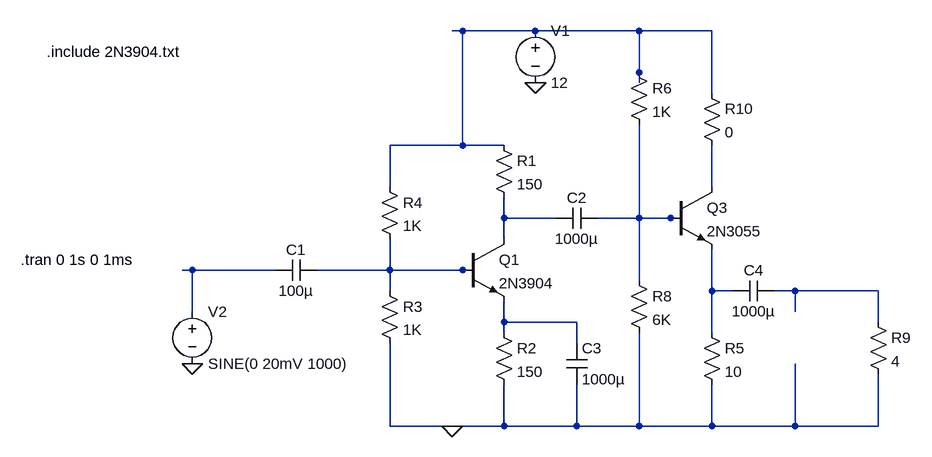
[diagram p0: schematic Common Emitter with 2N3904.asc]
Common Emitter with 2N3904.asc, the LTspice schematic file:
Version 4
SHEET 1 1032 680
WIRE 160 -256 144 -256
WIRE 272 -256 160 -256
WIRE 432 -256 272 -256
WIRE 544 -256 432 -256
WIRE 432 -192 432 -256
WIRE 432 -176 432 -192
WIRE 544 -160 544 -256
WIRE 160 -80 160 -256
WIRE 160 -80 48 -80
WIRE 224 -80 160 -80
WIRE 48 -16 48 -80
WIRE 544 -16 544 -80
WIRE 224 32 224 0
WIRE 304 32 224 32
WIRE 432 32 432 -112
WIRE 432 32 368 32
WIRE 480 32 432 32
WIRE 496 32 480 32
WIRE 224 64 224 32
WIRE -256 112 -272 112
WIRE -128 112 -256 112
WIRE 48 112 48 64
WIRE 48 112 -64 112
WIRE 160 112 48 112
WIRE 176 112 160 112
WIRE 432 128 432 32
WIRE 48 144 48 112
WIRE 544 144 544 80
WIRE 576 144 544 144
WIRE 672 144 640 144
WIRE 800 144 672 144
WIRE -256 176 -256 112
WIRE 672 176 672 144
WIRE 224 192 224 160
WIRE 336 192 224 192
WIRE 800 192 800 144
WIRE 224 208 224 192
WIRE 544 208 544 144
WIRE 336 224 336 192
WIRE 48 352 48 224
WIRE 144 352 48 352
WIRE 224 352 224 288
WIRE 224 352 144 352
WIRE 336 352 336 288
WIRE 336 352 224 352
WIRE 432 352 432 208
WIRE 432 352 336 352
WIRE 544 352 544 288
WIRE 544 352 432 352
WIRE 672 352 672 256
WIRE 672 352 544 352
WIRE 800 352 800 272
WIRE 800 352 672 352
FLAG 272 -176 0
FLAG 144 352 0
FLAG -256 256 0
SYMBOL npn 160 64 R0
SYMATTR InstName Q1
SYMATTR Value 2N3904
SYMBOL res 208 -96 R0
SYMATTR InstName R1
SYMATTR Value 150
SYMBOL voltage 272 -272 R0
WINDOW 123 0 0 Left 2
WINDOW 39 0 0 Left 2
SYMATTR InstName V1
SYMATTR Value 12
SYMBOL res 32 -32 R0
SYMATTR InstName R4
SYMATTR Value 1K
SYMBOL res 32 128 R0
SYMATTR InstName R3
SYMATTR Value 1K
SYMBOL res 208 192 R0
SYMATTR InstName R2
SYMATTR Value 150
SYMBOL cap 320 224 R0
SYMATTR InstName C3
SYMATTR Value 1000µ
SYMBOL voltage -256 160 R0
WINDOW 123 0 0 Left 2
WINDOW 39 0 0 Left 2
SYMATTR InstName V2
SYMATTR Value SINE(0 20mV 1000)
SYMBOL npn2 480 -16 R0
SYMATTR InstName Q3
SYMATTR Value 2N3055
SYMBOL res 528 192 R0
SYMATTR InstName R5
SYMATTR Value 10
SYMBOL cap -64 96 R90
WINDOW 0 0 32 VBottom 2
WINDOW 3 32 32 VTop 2
SYMATTR InstName C1
SYMATTR Value 100µ
SYMBOL res 416 -208 R0
SYMATTR InstName R6
SYMATTR Value 1K
SYMBOL cap 368 16 R90
WINDOW 0 0 32 VBottom 2
WINDOW 3 32 32 VTop 2
SYMATTR InstName C2
SYMATTR Value 1000µ
SYMBOL cap 640 128 R90
WINDOW 0 0 32 VBottom 2
WINDOW 3 32 32 VTop 2
SYMATTR InstName C4
SYMATTR Value 1000µ
SYMBOL res 416 112 R0
SYMATTR InstName R8
SYMATTR Value 6K
SYMBOL res 784 176 R0
SYMATTR InstName R9
SYMATTR Value 4
SYMBOL res 528 -176 R0
SYMATTR InstName R10
SYMATTR Value 0
TEXT -520 96 Left 2 !.tran 0 1s 0 1ms
TEXT -480 -224 Left 2 !.include 2N3904.txt

The netlist it stands for:
* Common Emitter with 2N3904.asc
Q1 N003 N006 N009 0 2N3904
R1 N001 N003 150
V1 N001 0 12
R4 N001 N006 1K
R3 N006 0 1K
R2 N009 0 150
C3 N009 0 1000µ
V2 N005 0 SINE(0 20mV 1000)
Q3 N002 N004 N007 0 2N3055
R5 N007 0 10
C1 N006 N005 100µ
R6 N001 N004 1K
C2 N004 N003 1000µ
C4 N008 N007 1000µ
R8 N004 0 6K
R9 N008 0 4
R10 N001 N002 0
.model NPN NPN
.model PNP PNP
.lib standard.bjt
.tran 0 1s 0 1ms
.include 2N3904.txt
.backanno
.end